# Altium schematic sheet Audio.SchDoc
size 594 x 420 mm
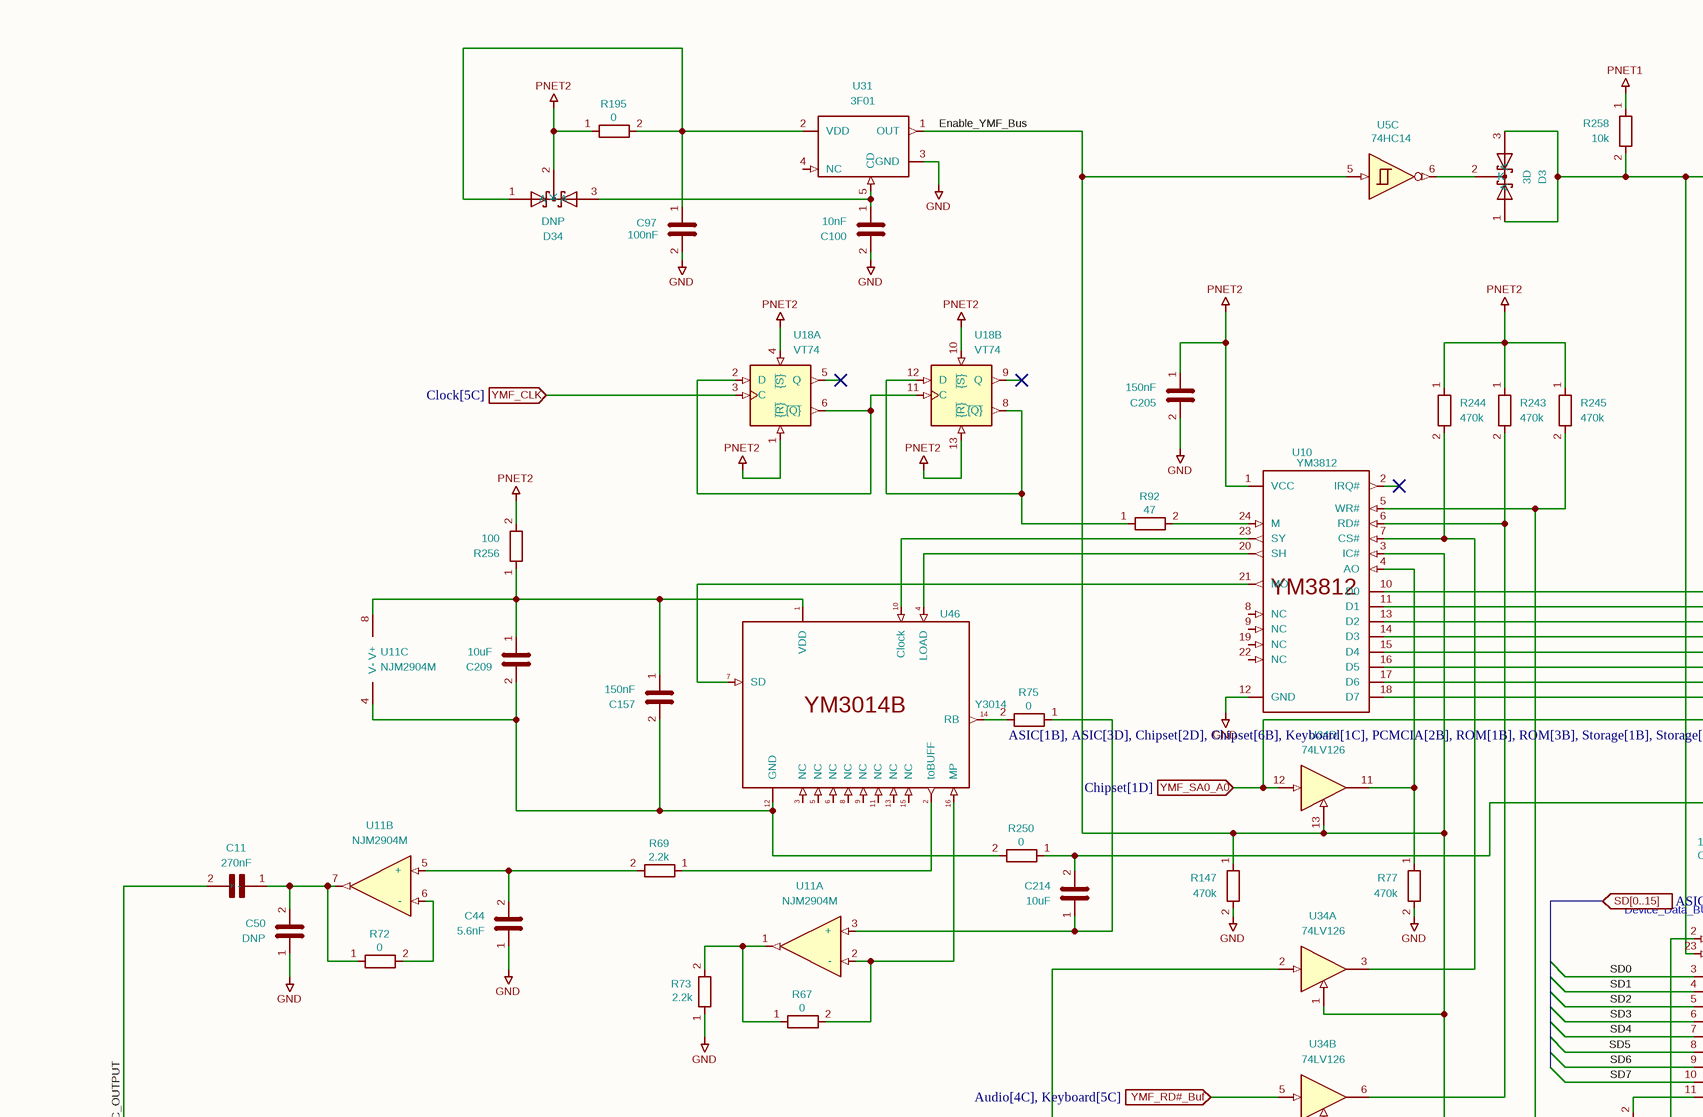
[diagram p0: Audio.SchDoc, top left]
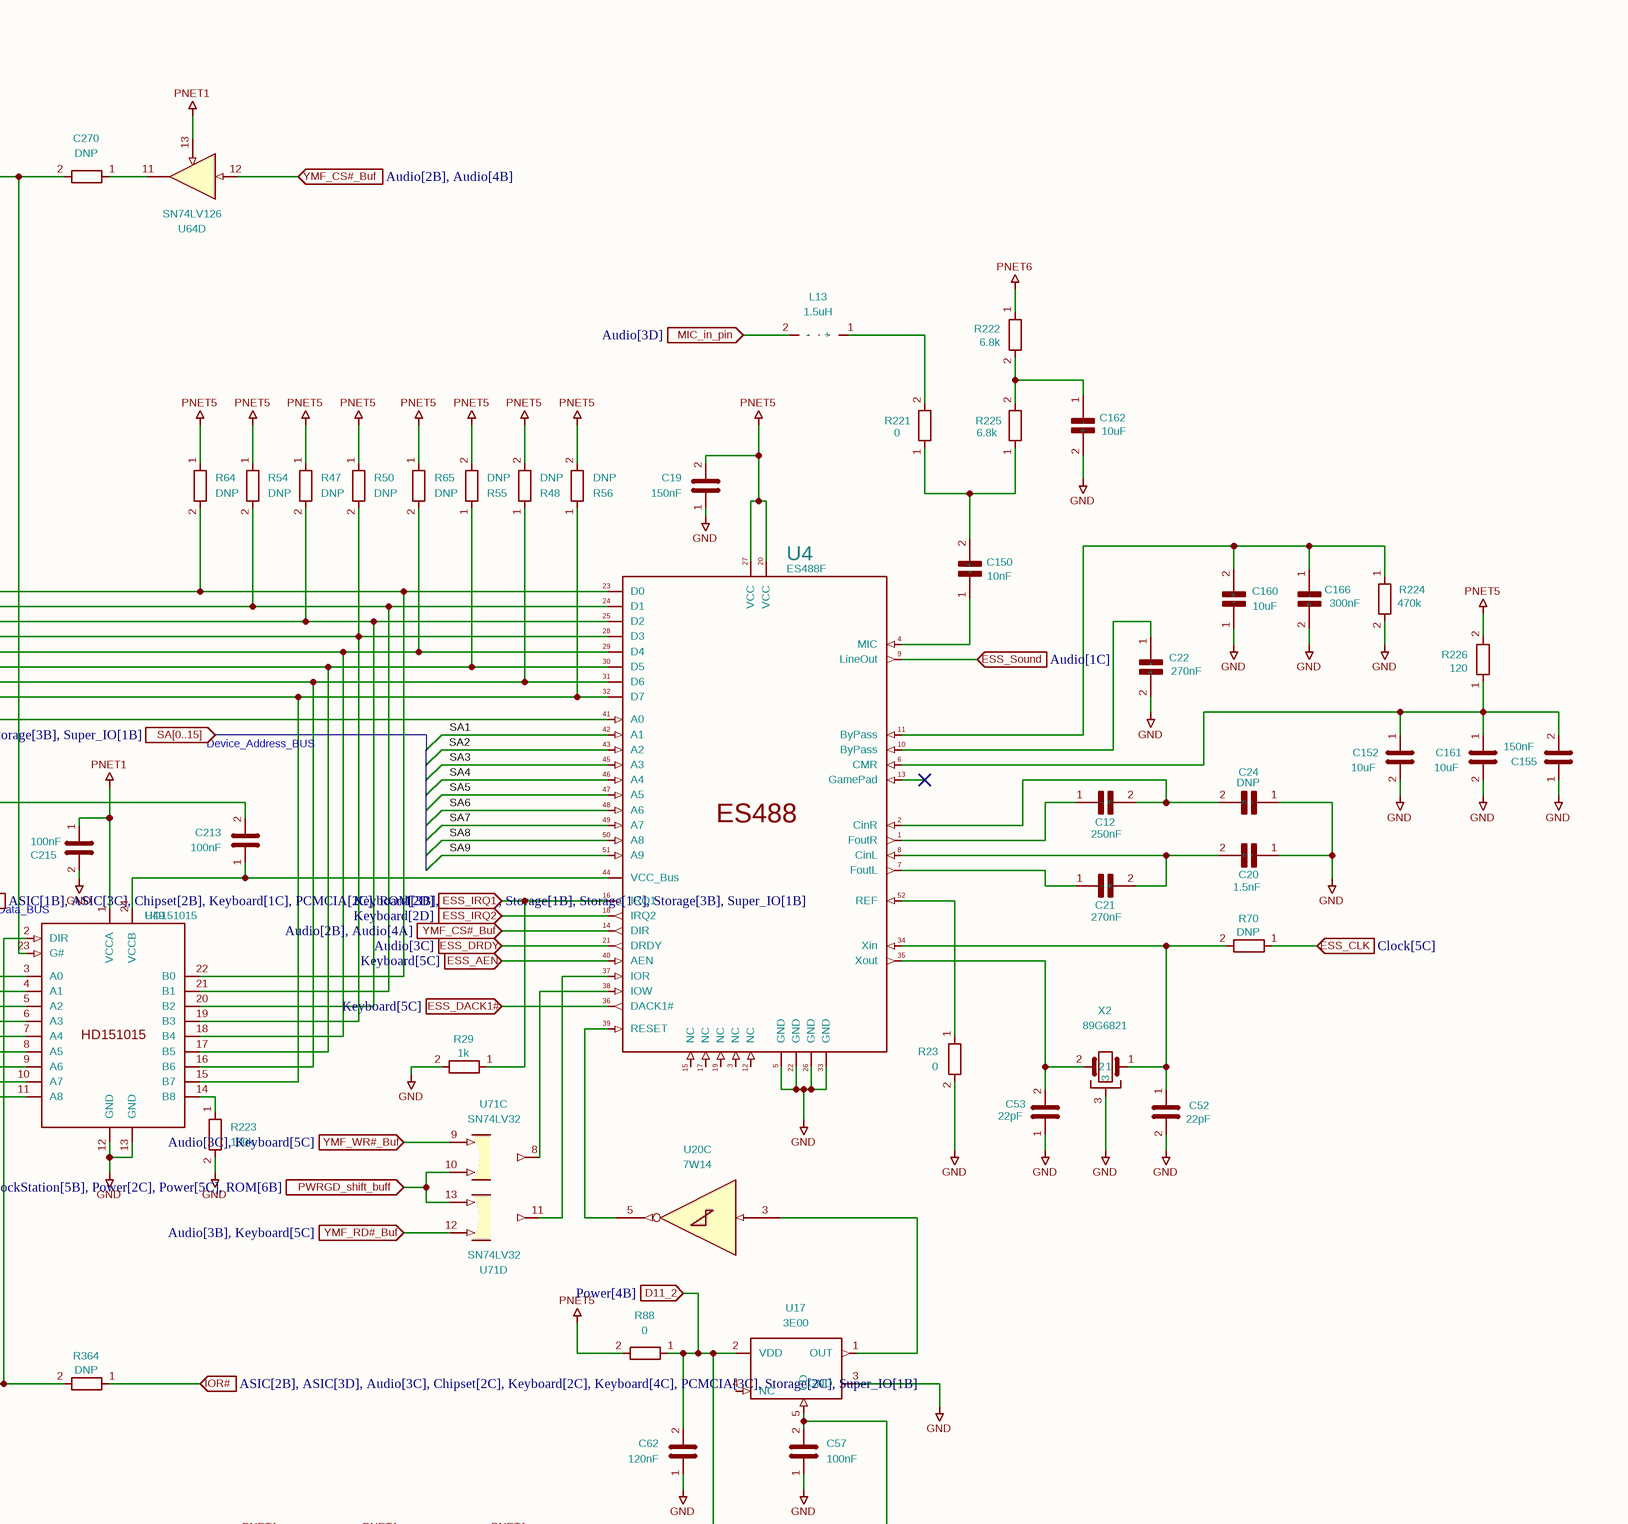
[diagram p1: Audio.SchDoc, top right]
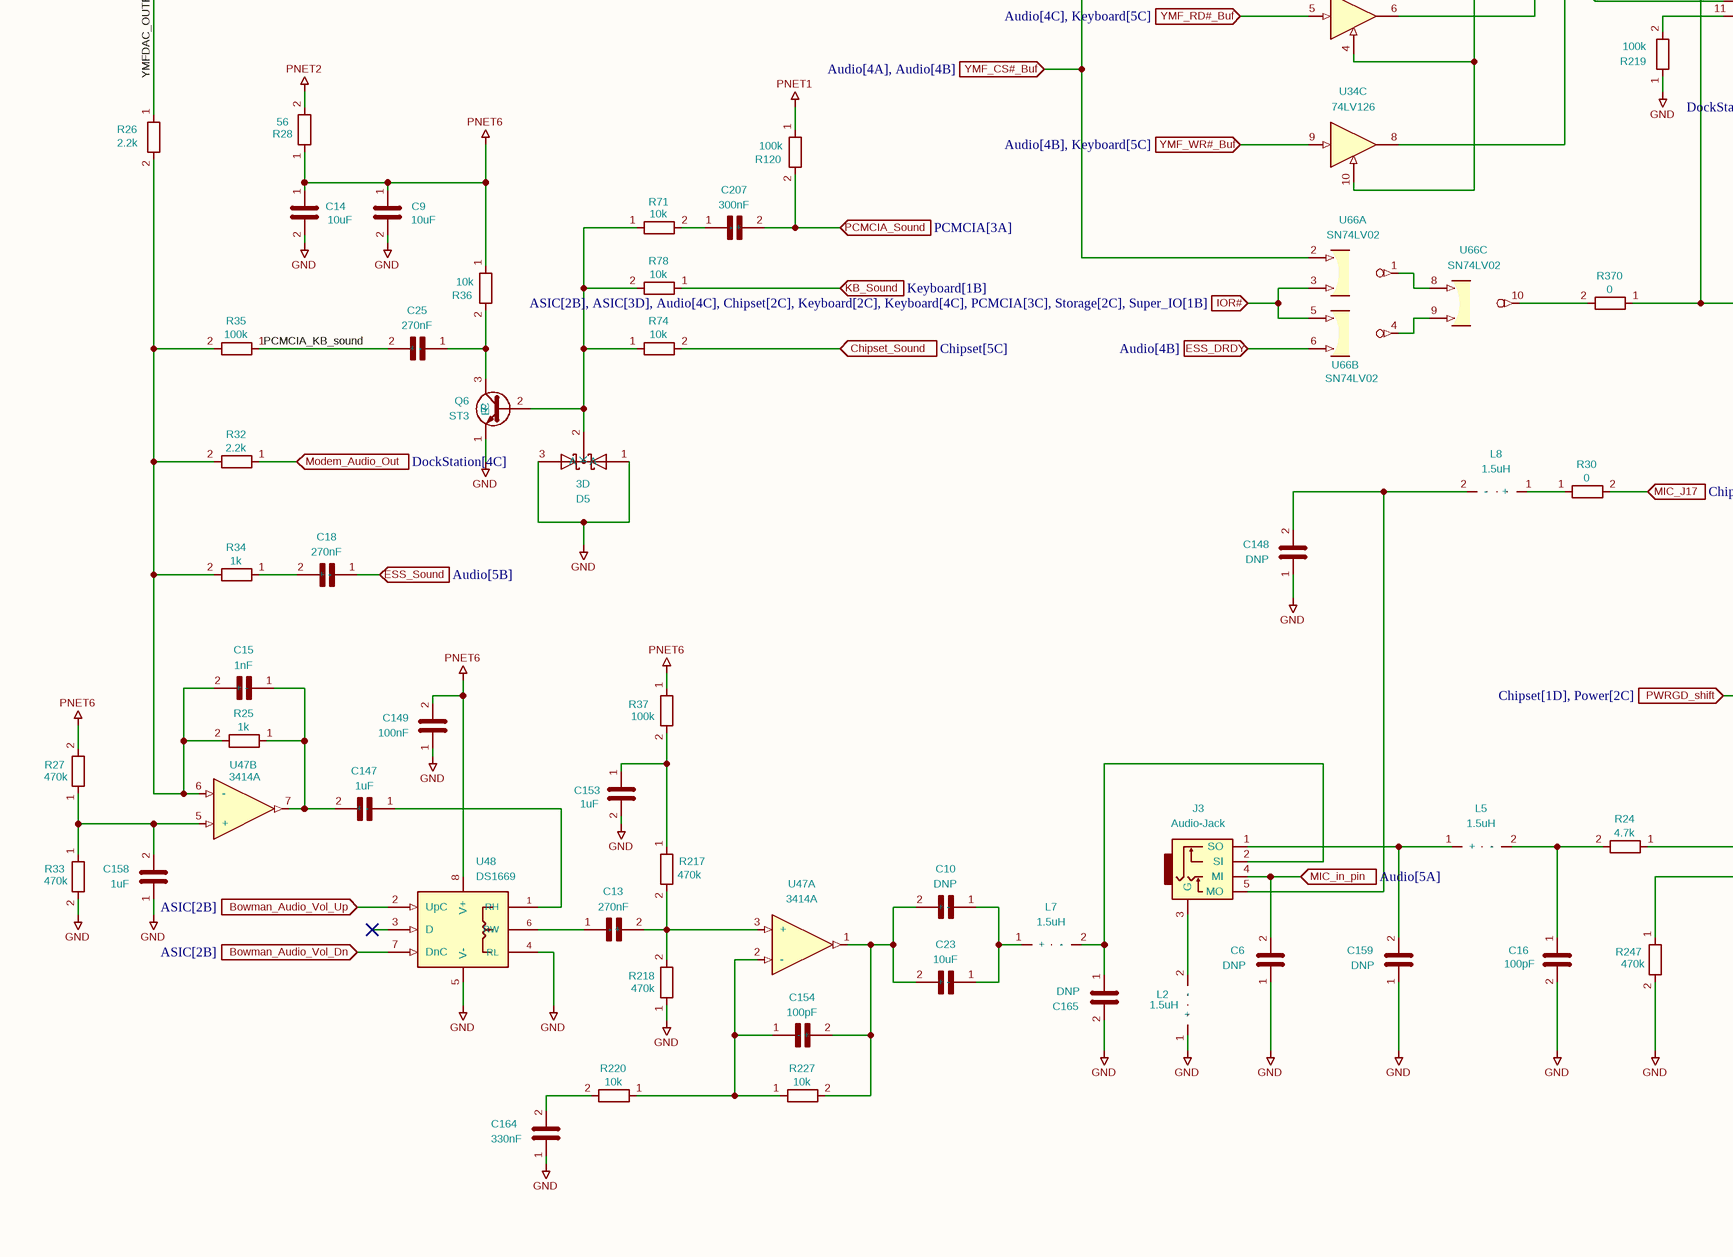
[diagram p2: Audio.SchDoc, bottom left]
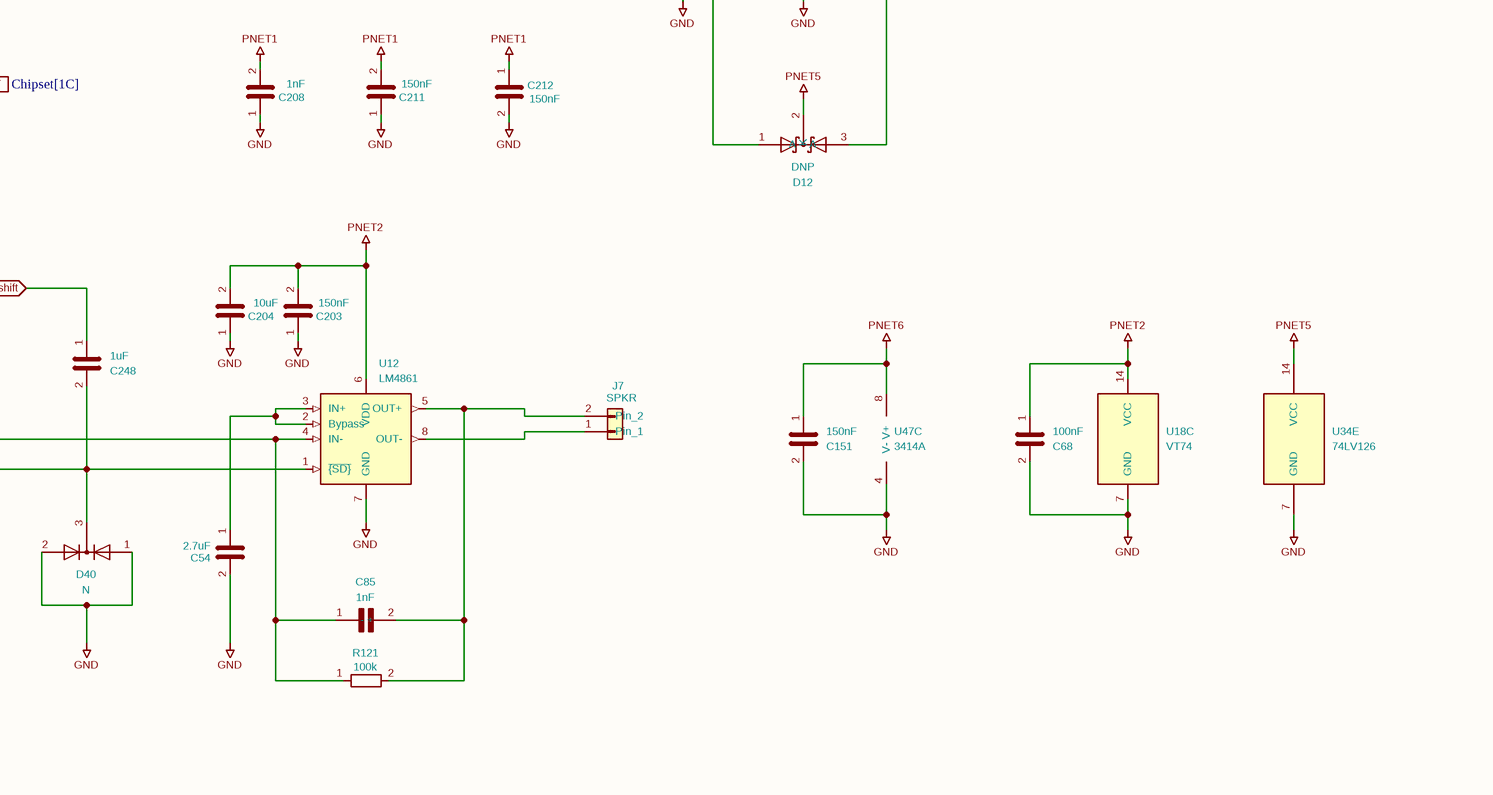
[diagram p3: Audio.SchDoc, bottom right]

## Parts
C6  DNP  [C_0402_1005Metric]
C9  10uF  [C_1206_3216Metric]
C10  DNP  [C_1206_3216Metric]
C11  270nF  [C_0603_1608Metric]
C12  250nF  [C_0603_1608Metric]
C13  270nF  [C_0603_1608Metric]
C14  10uF  [C_1206_3216Metric]
C15  1nF  [C_0402_1005Metric]
C16  100pF  [C_0402_1005Metric]
C18  270nF  [C_0603_1608Metric]
C19  150nF  [C_0402_1005Metric]
C20  1.5nF  [C_0402_1005Metric]
C21  270nF  [C_0603_1608Metric]
C22  270nF  [C_0603_1608Metric]
C23  10uF  [C_1206_3216Metric]
C24  DNP  [C_0402_1005Metric]
C25  270nF  [C_0603_1608Metric]
C44  5.6nF  [C_0402_1005Metric]
C50  DNP  [C_0402_1005Metric]
C52  22pF  [C_0402_1005Metric]
C53  22pF  [C_0402_1005Metric]
C54  2.7uF  [C_0805_2012Metric]
C57  100nF  [C_0603_1608Metric]
C62  120nF  [C_0402_1005Metric]
C68  100nF  [C_0402_1005Metric]
C85  1nF  [C_0402_1005Metric]
C97  100nF  [C_0402_1005Metric]
C100  10nF  [C_0603_1608Metric]
C147  1uF  [C_0603_1608Metric]
C148  DNP  [C_0402_1005Metric]
C149  100nF  [C_0402_1005Metric]
C150  10nF  [C_0603_1608Metric]
C151  150nF  [C_0402_1005Metric]
C152  10uF  [C_1206_3216Metric]
C153  1uF  [C_0603_1608Metric]
C154  100pF  [C_0402_1005Metric]
C155  150nF  [C_0402_1005Metric]
C157  150nF  [C_0402_1005Metric]
C158  1uF  [C_0603_1608Metric]
C159  DNP  [C_0402_1005Metric]
C160  10uF  [C_1206_3216Metric]
C161  10uF  [C_1206_3216Metric]
C162  10uF  [C_1206_3216Metric]
C164  330nF  [C_0603_1608Metric]
C165  DNP  [C_0402_1005Metric]
C166  300nF  [C_0603_1608Metric]
C203  150nF  [C_0402_1005Metric]
C204  10uF  [C_1206_3216Metric]
C205  150nF  [C_0402_1005Metric]
C207  300nF  [C_0603_1608Metric]
C208  1nF  [C_0402_1005Metric]
C209  10uF  [C_1206_3216Metric]
C211  150nF  [C_0402_1005Metric]
C212  150nF  [C_0402_1005Metric]
C213  100nF  [C_0402_1005Metric]
C214  10uF  [C_1206_3216Metric]
C215  100nF  [C_0402_1005Metric]
C248  1uF  [C_0603_1608Metric]
C270  DNP  [C_0402_1005Metric]
D3  3D  [3D]
D5  3D  [3D]
D12  DNP  [3D]
D34  DNP  [3D]
D40  N  [SOT-416L]
J3  Audio-Jack  [Audio-Jack]
J7  SPKR  [SPKR]
L2  1.5uH  [L_0603_1608Metric]
L5  1.5uH  [L_0603_1608Metric]
L7  1.5uH  [L_0603_1608Metric]
L8  1.5uH  [L_0603_1608Metric]
L13  1.5uH  [L_0603_1608Metric]
Q6  ST3  [SOT-416L]
R23  0  [R_0402_1005Metric]
R24  4.7k  [R_0402_1005Metric]
R25  1k  [R_0402_1005Metric]
R26  2.2k  [R_0402_1005Metric]
R27  470k  [R_0402_1005Metric]
R28  56  [R_1206_3216Metric]
R29  1k  [R_0402_1005Metric]
R30  0  [R_0402_1005Metric]
R32  2.2k  [R_0402_1005Metric]
R33  470k  [R_0402_1005Metric]
R34  1k  [R_0402_1005Metric]
R35  100k  [R_0402_1005Metric]
R36  10k  [R_0402_1005Metric]
R37  100k  [R_0402_1005Metric]
R47  DNP  [R_0402_1005Metric]
R48  DNP  [R_0402_1005Metric]
R50  DNP  [R_0402_1005Metric]
R54  DNP  [R_0402_1005Metric]
R55  DNP  [R_0402_1005Metric]
R56  DNP  [R_0402_1005Metric]
R64  DNP  [R_0402_1005Metric]
R65  DNP  [R_0402_1005Metric]
R67  0  [R_0402_1005Metric]
R69  2.2k  [R_0402_1005Metric]
R70  DNP  [R_0402_1005Metric]
R71  10k  [R_0402_1005Metric]
R72  0  [R_0402_1005Metric]
R73  2.2k  [R_0402_1005Metric]
R74  10k  [R_0402_1005Metric]
R75  0  [R_0402_1005Metric]
R77  470k  [R_0402_1005Metric]
R78  10k  [R_0402_1005Metric]
R88  0  [R_0402_1005Metric]
R92  47  [R_0402_1005Metric]
R120  100k  [R_0402_1005Metric]
R121  100k  [R_0402_1005Metric]
R147  470k  [R_0402_1005Metric]
R195  0  [R_0402_1005Metric]
R217  470k  [R_0402_1005Metric]
R218  470k  [R_0402_1005Metric]
R219  100k  [R_0402_1005Metric]
R220  10k  [R_0402_1005Metric]
R221  0  [R_0402_1005Metric]
R222  6.8k  [R_0402_1005Metric]
R223  100k  [R_0402_1005Metric]
R224  470k  [R_0402_1005Metric]
R225  6.8k  [R_0402_1005Metric]
R226  120  [R_1206_3216Metric]
R227  10k  [R_0402_1005Metric]
R243  470k  [R_0402_1005Metric]
R244  470k  [R_0402_1005Metric]
R245  470k  [R_0402_1005Metric]
R247  470k  [R_0402_1005Metric]
R250  0  [R_0805_2012Metric]
R256  100  [R_0805_2012Metric]
R258  10k  [R_0402_1005Metric]
R364  DNP  [R_0402_1005Metric]
R370  0  [R_0402_1005Metric]
U4  ES488F  [QFN-52]
U5  74HC14  [TSSOP-14_4.4x5mm_P0.65mm]  (part C of 7)
U10  YM3812  [SOP-24]
U11  NJM2904M  [soic-8-small]  (parts A,B,C of 3)
U12  LM4861  [SOIC-8-narrow]
U17  3E00  [SOT-23-5]
U18  VT74  [TSSOP-14_4.4x5mm_P0.65mm]  (parts A,B,C of 3)
U20  7W14  [sso-8]  (part C of 4)
U31  3F01  [SOT-23-5]
U34  74LV126  [TSSOP-14_4.4x5mm_P0.65mm]  (parts A,B,C,D,E of 5)
U46  Y3014  [SOP-16]
U47  3414A  [SOIC-8]  (parts A,B,C of 3)
U48  DS1669  [SOIC-8]
U49  HD151015  [SSOP-24_5.3x8.2mm_P0.65mm]
U64  SN74LV126  [TSSOP-14_4.4x5mm_P0.65mm]  (part D of 5)
U66  SN74LV02  [TSSOP-14_4.4x5mm_P0.65mm]  (parts A,B,C of 5)
U71  SN74LV32  [TSSOP-14_4.4x5mm_P0.65mm]  (parts C,D of 5)
X2  89G6821  [XTAL-1]

## Ports
Bowman_Audio_Vol_Dn (in, see ASIC[2B]), Bowman_Audio_Vol_Up (in, see ASIC[2B]), Chipset_Sound (in, see Chipset[5C]), D11_2 (in, see Power[4B]), ESS_AEN (in, see Keyboard[5C]), ESS_CLK (in, see Clock[5C]), ESS_DACK1# (in, see Keyboard[5C]), ESS_DRDY (in, see Audio[3C]), ESS_DRDY (in, see Audio[4B]), ESS_IRQ1 (in, see Keyboard[2D]), ESS_IRQ2 (in, see Keyboard[2D]), ESS_Sound (in, see Audio[1C]), ESS_Sound (in, see Audio[5B]), IOR# (in, see ASIC[2B], ASIC[3D], Audio[3C], Chipset[2C], Keyboard[2C], Keyboard[4C], PCMCIA[3C], Storage[2C], Super_IO[1B]), IOR# (in, see ASIC[2B], ASIC[3D], Audio[4C], Chipset[2C], Keyboard[2C], Keyboard[4C], PCMCIA[3C], Storage[2C], Super_IO[1B]), KB_Sound (in, see Keyboard[1B]), MIC_in_pin (in, see Audio[3D]), MIC_in_pin (in, see Audio[5A]), MIC_J17 (in, see Chipset[1C]), Modem_Audio_Out (in, see DockStation[4C]), PCMCIA_Sound (in, see PCMCIA[3A]), PWRGD_shift (in, see Chipset[1D], Power[2C]), PWRGD_shift_buff (in, see DockStation[5B], Power[2C], Power[5C], ROM[6B]), SA[0..15] (in, see ASIC[1B], ASIC[3D], Chipset[2D], Chipset[6B], Keyboard[1C], PCMCIA[2B], ROM[1B], ROM[3B], Storage[1B], Storage[3B], Super_IO[1B]), SD[0..15] (in, see ASIC[1B], ASIC[3C], Chipset[2B], Keyboard[1C], PCMCIA[2C], ROM[3B], ROM[5C], Storage[1B], Storage[1C], Storage[3B], Super_IO[1B]), YMF_CLK (in, see Clock[5C]), YMF_CS#_Buf (in, see Audio[2B], Audio[4A]), YMF_CS#_Buf (in, see Audio[2B], Audio[4B]), YMF_CS#_Buf (in, see Audio[4A], Audio[4B]), YMF_RD#_Buf (in, see Audio[3B], Keyboard[5C]), YMF_RD#_Buf (in, see Audio[4C], Keyboard[5C]), YMF_SA0_A0 (in, see Chipset[1D]), YMF_WR#_Buf (in, see Audio[3C], Keyboard[5C]), YMF_WR#_Buf (in, see Audio[4B], Keyboard[5C])

## Nets
GND: C6.1 C9.2 C14.2 C16.2 C19.1 C20.1(+) C22.2(-) C24.1(+) C44.1 C50.1 C52.2 C53.1 C54.2 C57.1 C62.1 C68.2 C97.2 C100.2 C148.1 C149.1 C151.2 C152.2 C153.2 C155.1 C158.1 C159.1 C160.1(+) C161.2 C162.2(-) C164.1 C165.2 C166.2(-) C203.1 C204.1 C205.2 C208.1 C211.1 C212.2 C215.2 D5.1(A) D5.3(A) D40.1 D40.2 L2.1(+) Q6.1(E) R23.2 R29.2 R33.2 R73.1 R77.2 R147.2 R218.1 R219.1 R223.2 R224.2 R247.2 U4.5(GND) U4.22(GND) U4.26(GND) U4.33(GND) U10.12(GND) U12.7(GND) U17.3(GND) U18.7(GND) U31.3(GND) U34.7(GND) U47.4(V-) U48.4(RL) U48.5(V-) U49.12(GND) U49.13(GND) X2.3
PNET1: C208.2 C211.2 C212.1 C215.1 R120.1 R258.1 U49.1(VCCA) U64.13
PNET2: C68.1 C203.2 C204.2 C205.1 D34.2(K) R28.2 R195.1 R243.1 R244.1 R245.1 R256.2 U10.1(VCC) U12.6(VDD) U18.1(~{{R}}) U18.4(~{{S}}) U18.10(~{{S}}) U18.13(~{{R}}) U18.14(VCC)
PNET5: C19.2 D12.2(K) R47.1 R48.2 R50.1 R54.1 R55.2 R56.2 R64.1 R65.1 R88.2 R226.2 U4.20(VCC) U4.27(VCC) U34.14(VCC)
PNET6: C9.1 C14.1 C149.2 C151.1 R27.2 R28.1 R36.1 R37.1 R222.1 U47.8(V+) U48.8(V+)
Bowman_Audio_Vol_Dn: U48.7(DnC) ; port Bowman_Audio_Vol_Dn
Bowman_Audio_Vol_Up: U48.2(UpC) ; port Bowman_Audio_Vol_Up
Chipset_Sound: R74.2 ; port Chipset_Sound
D11_2: C62.2 D12.1(A) R88.1 U17.2(VDD) ; port D11_2
Enable_YMF_Bus: R147.1 U5.5 U10.3(IC#) U31.1(OUT) U34.1 U34.4 U34.10 U34.13
ESS_AEN: U4.40(AEN) ; port ESS_AEN
ESS_CLK: R70.1 ; port ESS_CLK
ESS_DACK1#: U4.36(DACK1#) ; port ESS_DACK1#
ESS_DRDY: U4.21(DRDY) U66.6 ; port ESS_DRDY
ESS_IRQ1: R29.1 U4.16(IRQ1) ; port ESS_IRQ1
ESS_IRQ2: U4.18(IRQ2) ; port ESS_IRQ2
ESS_Sound: C18.1(+) U4.9(LineOut) ; port ESS_Sound
IOR#: R364.1 U66.3 U66.5 ; port IOR#
KB_Sound: R78.1 ; port KB_Sound
MIC_in_pin: C6.2 J3.4(MI) L13.2(-) ; port MIC_in_pin
MIC_J17: R30.2 ; port MIC_J17
Modem_Audio_Out: R32.1 ; port Modem_Audio_Out
PCMCIA_KB_sound: C25.2(-) R35.1
PCMCIA_Sound: C207.2(-) R120.2 ; port PCMCIA_Sound
PWRGD_shift: C248.1 ; port PWRGD_shift
PWRGD_shift_buff: U71.10 U71.13 ; port PWRGD_shift_buff
SA1: U4.42(A1)
SA2: U4.43(A2)
SA3: U4.45(A3)
SA4: U4.46(A4)
SA5: U4.47(A5)
SA6: U4.48(A6)
SA7: U4.49(A7)
SA8: U4.50(A8)
SA9: U4.51(A9)
SD0: U49.3(A0)
SD1: U49.4(A1)
SD2: U49.5(A2)
SD3: U49.6(A3)
SD4: U49.7(A4)
SD5: U49.8(A5)
SD6: U49.9(A6)
SD7: U49.10(A7)
YMF_CLK: U18.3(C) ; port YMF_CLK
YMF_CS#_Buf: U4.14(DIR) U34.2 U64.12 U66.2 ; port YMF_CS#_Buf
YMF_RD#_Buf: U34.5 U71.12 ; port YMF_RD#_Buf
YMF_SA0_A0: U4.41(A0) U34.12 ; port YMF_SA0_A0
YMF_WR#_Buf: U34.9 U71.9 ; port YMF_WR#_Buf
YMFDAC_OUTPUT: C11.2(-) R26.1
NetC10_1: C10.1(+) C23.1(+) L7.1(+)
NetC10_2: C10.2(-) C23.2(-) C154.2(-) R227.2 U47.1
NetC11_1: C11.1(+) C50.2 R72.1 U11.7
NetC12_1: C12.1(+) U4.1(FoutR)
NetC12_2: C12.2(-) C24.2(-) U4.2(CinR)
NetC13_1: C13.1(+) U48.6(RW)
NetC13_2: C13.2(-) R217.2 R218.2 U47.3(+)
NetC15_1: C15.1(+) C147.2(-) R25.1 U47.7
NetC15_2: C15.2(-) R25.2 R26.2 R32.2 R34.2 R35.2 U47.6(-)
NetC16_1: C16.1 L5.2(-) R24.2
NetC18_2: C18.2(-) R34.1
NetC20_2: C20.2(-) C21.2(-) U4.8(CinL)
NetC21_1: C21.1(+) U4.7(FoutL)
NetC22_1: C22.1(+) U4.10(ByPass)
NetC25_1: C25.1(+) Q6.3(C) R36.2
NetC44_2: C44.2 R69.2 U11.5(+)
NetC52_1: C52.1 R70.2 U4.34(Xin) X2.1
NetC53_2: C53.2 U4.35(Xout) X2.2
NetC54_1: C54.1 U12.2(Bypass) U12.3(IN+)
NetC57_2: C57.2 D12.3(A) U17.5(CD)
NetC85_1: C85.1(+) R24.1 R121.1 U12.4(IN-)
NetC85_2: C85.2(-) J7.2(Pin_2) R121.2 U12.5(OUT+)
NetC97_1: C97.1 D34.1(A) R195.2 U31.2(VDD)
NetC100_1: C100.1 D34.3(A) U31.5(CD)
NetC147_1: C147.1(+) U48.1(RH)
NetC148_2: C148.2 J3.5(MO) L8.2(-)
NetC150_1: C150.1(+) U4.4(MIC)
NetC150_2: C150.2(-) R221.1 R225.1
NetC152_1: C152.1 C155.2 C161.1 R226.1 U4.6(CMR)
NetC153_1: C153.1 R37.2 R217.1
NetC154_1: C154.1(+) R220.1 R227.1 U47.2(-)
NetC157_1: C157.1 C209.1 R256.1 U11.8(V+) U46.1(VDD)
NetC157_2: C157.2 C209.2 R250.2 U11.4(V-) U46.12(GND)
NetC158_2: C158.2 R27.1 R33.1 U47.5(+)
NetC159_2: C159.2 J3.1(SO) L5.1(+)
NetC160_2: C160.2(-) C166.1(+) R224.1 U4.11(ByPass)
NetC162_1: C162.1(+) R222.2 R225.2
NetC164_2: C164.2 R220.2
NetC165_1: C165.1 J3.2(SI) L7.2(-)
NetC207_1: C207.1(+) R71.2
NetC213_1: C213.1 U4.44(VCC_Bus) U49.24(VCCB)
NetC213_2: C213.2 C214.2 R250.1
NetC214_1: C214.1 R75.1 U11.3(+)
NetC248_2: C248.2 D40.3 R247.1 U12.1(~{{SD}})
NetC270_1: C270.1 U64.11
NetC270_2: C270.2 D3.1(A) D3.3(A) R258.2 U49.23(G#)
NetD3_2: D3.2(K) U5.6
NetD5_2: D5.2(K) Q6.2(B) R71.1 R74.1 R78.2
NetJ3_3: J3.3(G) L2.2(-)
NetJ7_1: J7.1(Pin_1) U12.8(OUT-)
NetL8_1: L8.1(+) R30.1
NetL13_1: L13.1(+) R221.2
NetR23_1: R23.1 U4.52(REF)
NetR47_2: R47.2 U4.25(D2) U10.13(D2) U49.20(B2)
NetR48_1: R48.1 U4.31(D6) U10.17(D6) U49.16(B6)
NetR50_2: R50.2 U4.28(D3) U10.14(D3) U49.19(B3)
NetR54_2: R54.2 U4.24(D1) U10.11(D1) U49.21(B1)
NetR55_1: R55.1 U4.30(D5) U10.16(D5) U49.17(B5)
NetR56_1: R56.1 U4.32(D7) U10.18(D7) U49.15(B7)
NetR64_2: R64.2 U4.23(D0) U10.10(D0) U49.22(B0)
NetR65_2: R65.2 U4.29(D4) U10.15(D4) U49.18(B4)
NetR67_1: R67.1 R73.2 U11.1
NetR67_2: R67.2 U11.2(-) U46.16(MP)
NetR69_1: R69.1 U46.2(toBUFF)
NetR72_2: R72.2 U11.6(-)
NetR75_2: R75.2 U46.14(RB)
NetR77_1: R77.1 U10.4(AO) U34.11
NetR92_1: R92.1 U18.8(~{{Q}}) U18.12(D)
NetR92_2: R92.2 U10.24(M)
NetR219_2: R219.2 U49.11(A8)
NetR223_1: R223.1 U49.14(B8)
NetR243_2: R243.2 U10.6(RD#) U34.6
NetR244_2: R244.2 U10.7(CS#) U34.3
NetR245_2: R245.2 U10.5(WR#) U34.8
NetR364_2: R364.2 R370.1 U49.2(DIR)
NetR370_2: R370.2 U66.10
NetU4_37: U4.37(IOR) U71.11
NetU4_38: U4.38(IOW) U71.8
NetU4_39: U4.39(RESET) U20.5
NetU10_20: U10.20(SH) U46.4(LOAD)
NetU10_21: U10.21(MO) U46.7(SD)
NetU10_23: U10.23(SY) U46.10(Clock)
NetU17_1: U17.1(OUT) U20.3
NetU18_2: U18.2(D) U18.6(~{{Q}}) U18.11(C)
NetU66_1: U66.1 U66.8
NetU66_4: U66.4 U66.9

Not connected (* = marked no-connect by the designer): U4 3(NC) 12(NC) 13(GamePad)* 15(NC) 17(NC) 19(NC); U10 2(IRQ#)* 8(NC) 9(NC) 19(NC) 22(NC); U17 4(NC); U18 5(Q)* 9(Q)*; U31 4(NC); U46 3(NC) 5(NC) 6(NC) 8(NC) 9(NC) 11(NC) 13(NC) 15(NC); U48 3(D)*

## Notes on the sheet
- Device_Address_BUS
- (near U49) Device_Data_BUS
- 1
- 2
- 3
- 4
- 5
- 6
- 7
- 8
- 9
- 10
- 11
- A
- B
- C
- D
- E
- F
- G
- H
- Title: PC110
- File: Audio.kicad_sch
- Sheet: /
- Recreated by: Ahmad Byagowi
- KiCad E.D.A.  kicad (5.1.4)-1
- Size: A2
- Date:
- Rev:
- Id: 1/1
- (in symbol YM3014) YM3014B

## Library data of the parts
C6 C9-C16 C18-C25 C44 C50 C52-C54 C57 C62 C68 C85 C97 C100 C147-C155 C157-C162 C164-C166 C203-C205 C207-C209 C211-C215 C248 = C
  C6 C24 C50 C148 C159 C165: Value: DNP; Footprint: Capacitor_SMD:C_0402_1005Metric
  C9 C14 C23 C152 C160-C162 C204 C209 C214: Value: 10uF; Footprint: Capacitor_SMD:C_1206_3216Metric
  C10: Value: DNP; Footprint: Capacitor_SMD:C_1206_3216Metric
  C11 C13 C18 C21 C22 C25: Value: 270nF; Footprint: Capacitor_SMD:C_0603_1608Metric
  C12: Value: 250nF; Footprint: Capacitor_SMD:C_0603_1608Metric
  C15 C85 C208: Value: 1nF; Footprint: Capacitor_SMD:C_0402_1005Metric
  C16 C154: Value: 100pF; Footprint: Capacitor_SMD:C_0402_1005Metric
  C19 C151 C155 C157 C203 C205 C211 C212: Value: 150nF; Footprint: Capacitor_SMD:C_0402_1005Metric
  C20: Value: 1.5nF; Footprint: Capacitor_SMD:C_0402_1005Metric
  C44: Value: 5.6nF; Footprint: Capacitor_SMD:C_0402_1005Metric
  C52 C53: Value: 22pF; Footprint: Capacitor_SMD:C_0402_1005Metric
  C54: Value: 2.7uF; Footprint: Capacitor_SMD:C_0805_2012Metric
  C57: Value: 100nF; Footprint: Capacitor_SMD:C_0603_1608Metric
  C62: Value: 120nF; Footprint: Capacitor_SMD:C_0402_1005Metric
  C68 C97 C149 C213 C215: Value: 100nF; Footprint: Capacitor_SMD:C_0402_1005Metric
  C100 C150: Value: 10nF; Footprint: Capacitor_SMD:C_0603_1608Metric
  C147 C153 C158 C248: Value: 1uF; Footprint: Capacitor_SMD:C_0603_1608Metric
  C164: Value: 330nF; Footprint: Capacitor_SMD:C_0603_1608Metric
  C166 C207: Value: 300nF; Footprint: Capacitor_SMD:C_0603_1608Metric
C270 R23-R30 R32-R37 R47 R48 R50 R54-R56 R64 R65 R67 R69-R75 R77 R78 R88 R92 R120 R121 R147 R195 R217-R227 R243-R245 R247 R250 R256 R258 R364 R370 = R
  C270: Value: DNP; Footprint: Capacitor_SMD:C_0402_1005Metric
  R23 R30 R67 R72 R75 R88 R195 R221: Value: 0; Footprint: PCM_Resistor_SMD_AKL:R_0402_1005Metric
  R24: Value: 4.7k; Footprint: PCM_Resistor_SMD_AKL:R_0402_1005Metric
  R25 R29 R34: Value: 1k; Footprint: PCM_Resistor_SMD_AKL:R_0402_1005Metric
  R26 R32 R69 R73: Value: 2.2k; Footprint: PCM_Resistor_SMD_AKL:R_0402_1005Metric
  R27 R33 R77 R147 R217 R218 R224: Value: 470k; Footprint: PCM_Resistor_SMD_AKL:R_0402_1005Metric
  R28: Value: 56; Footprint: PCM_Resistor_SMD_AKL:R_1206_3216Metric
  R35 R37 R120 R121 R219 R223: Value: 100k; Footprint: PCM_Resistor_SMD_AKL:R_0402_1005Metric
  R36 R71 R74 R78 R220 R227 R258: Value: 10k; Footprint: PCM_Resistor_SMD_AKL:R_0402_1005Metric
  R47 R48 R50 R54-R56 R64 R65 R70: Value: DNP; Footprint: PCM_Resistor_SMD_AKL:R_0402_1005Metric
  R92: Value: 47; Footprint: PCM_Resistor_SMD_AKL:R_0402_1005Metric
  R222 R225: Value: 6.8k; Footprint: PCM_Resistor_SMD_AKL:R_0402_1005Metric
  R226: Value: 120; Footprint: PCM_Resistor_SMD_AKL:R_1206_3216Metric
  R243-R245 R247: Value: 470k; Footprint: Resistor_SMD:R_0402_1005Metric
  R250: Value: 0; Footprint: PCM_Resistor_SMD_AKL:R_0805_2012Metric
  R256: Value: 100; Footprint: PCM_Resistor_SMD_AKL:R_0805_2012Metric
  R364: Value: DNP; Footprint: Resistor_SMD:R_0402_1005Metric
  R370: Value: 0; Footprint: Resistor_SMD:R_0402_1005Metric
D3 D5 D12 D34 = D_Schottky_Dual_CommonCathode_AKA: Footprint: PC110:3D
  D3 D5: Value: 3D
  D12 D34: Value: DNP
D40 = 3D_Diode: Value: N; Footprint: PC110:SOT-416L
J3 = Audio_Jack: Value: Audio-Jack; Footprint: PC110:Audio-Jack
J7 = Conn_01x02: Value: SPKR; Footprint: PC110:SPKR
L2 L5 L7 L8 L13 = L: Value: 1.5uH; Footprint: Inductor_SMD:L_0603_1608Metric
Q6 = Q_NPN_Generic_EBC: Value: ST3; Footprint: PC110:SOT-416L
U4 = ES488: Value: ES488F; Footprint: PC110:QFN-52
U5 = 74LS14: Value: 74HC14; Footprint: Package_SO:TSSOP-14_4.4x5mm_P0.65mm
U11 = LM2904: Value: NJM2904M; Footprint: PC110:soic-8-small
U17 = QC01_1: Value: 3E00; Footprint: Package_TO_SOT_SMD:SOT-23-5
U18 = 74HC74: Value: VT74; Footprint: Package_SO:TSSOP-14_4.4x5mm_P0.65mm
U20 = 74LVC3G14: Value: 7W14; Footprint: PC110:sso-8
U31 = QC01: Value: 3F01; Footprint: Package_TO_SOT_SMD:SOT-23-5
U34 U64 = 74LS126: Footprint: Package_SO:TSSOP-14_4.4x5mm_P0.65mm
  U34: Value: 74LV126
  U64: Value: SN74LV126
U46 = YM3014: Value: Y3014; Footprint: PC110:SOP-16
U47 = Opamp_Dual: Value: 3414A; Footprint: PC110:SOIC-8
U66 = 74LS02: Value: SN74LV02; Footprint: Package_SO:TSSOP-14_4.4x5mm_P0.65mm
U71 = 74LS32: Value: SN74LV32; Footprint: Package_SO:TSSOP-14_4.4x5mm_P0.65mm
X2 = Crystal_GND3: Value: 89G6821; Footprint: PC110:XTAL-1
U10 = YM3812: Value: YM3812; Footprint: PC110:SOP-24
U12 = LM4861: Value: LM4861; Footprint: PC110:SOIC-8-narrow
U48 = DS1669: Value: DS1669; Footprint: PC110:SOIC-8
U49 = HD151015: Value: HD151015; Footprint: Package_SO:SSOP-24_5.3x8.2mm_P0.65mm